# Altium schematic sheet sch_sense+act.SchDoc
size A
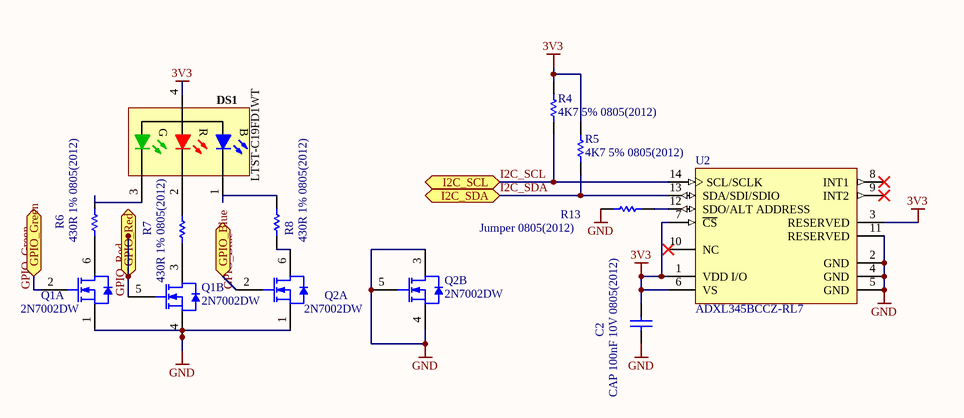
[diagram p0: sch_sense+act.SchDoc]

## Parts
(Parts that share a designator on the sheet are numbered #1, #2 ... from top to bottom, then left to right.)
C2  CAP 100nF 10V 0805(2012)  [CAPC0805(2012)100_N]
DS1  LTST-C19FD1WT  [LITO-LEDL210W160H55_V]
Q1#1  2N7002DW  [INF-PG-SOT-363_N]  (part A of 2)
Q1#2  2N7002DW  [INF-PG-SOT-363_N]  (part B of 2)
Q2#1  2N7002DW  [INF-PG-SOT-363_N]  (part A of 2)
Q2#2  2N7002DW  [INF-PG-SOT-363_N]  (part B of 2)
R4  4K7 5% 0805(2012)  [RESC0805(2012)_N]
R5  4K7 5% 0805(2012)  [RESC0805(2012)_N]
R6  430R 1% 0805(2012)  [RESC0805(2012)_L]
R7  430R 1% 0805(2012)  [RESC0805(2012)_L]
R8  430R 1% 0805(2012)  [RESC0805(2012)_L]
R13  Jumper 0805(2012)  [RESC0805(2012)_N]
U2  ADXL345BCCZ-RL7  [ADI-CC-14-1_V]

## Ports
GPIO_Blue (bidir), GPIO_Green (bidir), GPIO_Red (bidir), I2C_SCL (bidir), I2C_SDA (bidir)

## Nets
3V3: C2.1 DS1.4(A) R4.1 R5.1 U2.1(VDD_I/O) U2.3(RESERVED) U2.6(VS) U2.7(~{CS})
GND: C2.2 Q1#1.1(SOURCE_(1)) Q1#2.4(SOURCE_(2)) Q2#1.1(SOURCE_(1)) Q2#2.3(DRAIN_(2)) Q2#2.4(SOURCE_(2)) Q2#2.5(GATE_(2)) R13.1 U2.2(GND) U2.4(GND) U2.5(GND) U2.11(RESERVED)
GPIO_Blue: Q2#1.2(GATE_(1)) ; port GPIO_Blue
GPIO_Green: Q1#1.2(GATE_(1)) ; port GPIO_Green
GPIO_Red: Q1#2.5(GATE_(2)) ; port GPIO_Red
I2C_SCL: R4.2 U2.14(SCL/SCLK) ; port I2C_SCL
I2C_SDA: R5.2 U2.13(SDA/SDI/SDIO) ; port I2C_SDA
NetDS1_1: DS1.1(B) R8.2
NetDS1_2: DS1.2(R) R7.2
NetDS1_3: DS1.3(G) R6.2
NetQ1#1_6: Q1#1.6(DRAIN_(1)) R6.1
NetQ1#2_3: Q1#2.3(DRAIN_(2)) R7.1
NetQ2#1_6: Q2#1.6(DRAIN_(1)) R8.1
NetR13_2: R13.2 U2.12(SDO/ALT_ADDRESS)

Not connected (* = marked no-connect by the designer): U2 8(INT1)* 9(INT2)* 10(NC)*

## Library data of the parts
C2 = CMP-1036-04396-1: CAP 100nF 10V ±20% 0805 (2012 Metric) Thickness 1mm SMD; Tolerance: Â±20%; Case-Metric: 2012; Case-EIA: 0805; Rated Voltage: 10 V; Value: 100nF; Technology: SMT; Max Thickness: 1 mm
DS1 = CMP-0258-00001-1: SMD RGB Diffused; Reverse Voltage: 5 V; Forward Voltage Green: 3.5 V; Luminous Intensity Green: 280 MCD; Luminous Intensity Red: 180 MCD; Wavelength at Peak Emission Red: 611 nm; Forward Voltage Red: 2.0 V; Luminous Intensity Blue: 112 MCD; Power Dissipation Green: 80 mW; Power Dissipation Red: 75 mW; Wavelength at Peak Emission Blue: 468 nm; Wavelength at Peak Emission Green: 520 nm; PackageDescription: 4-Pin SMT LED, 2.1 x 1.6 mm Body, 0.55 mm Thickness; Mounting Technology: Suface Mount; PartNumber: LTST-C19FD1WT; LED Light Colour: RGB; PackageReference: LEDL210W160H55; ComponentLink1Description: Manufacturer URL; Power Dissipation Blue: 80 mW; ComponentLink2URL: Data Source:http://media.digikey.com/pdf/Data%20Sheets/Lite-On%20PDFs/LTST-C19FD1WT.pdf; Forward Voltage Blue: 3.5 V; ComponentLink2Description: URL Link1; ComponentLink1URL: http://www.liteon.com/
Q1#1 Q1#2 Q2#1 Q2#2 = CMP-1149-00044-1: N-Channel OptiMOS Small-Signal-Transistor, 60 V VDS, 0.3 A ID, -55 to 150 degC, PG-SOT-363, Reel, Green; Manufacturer: Infineon; ID (max): 0.3Â A; Green: TRUE; RthJA (max): 250 K/W; VDS (max): 60 V; VGS(th) (min): 1.5Â V; QG: 0.4Â nC; Ptot (max): 0.5Â W; VGS(th) (max): 2.5Â V; IDpuls (max): 1.2Â A; RDS (on) (max): 3,000 mOhm; RDS (on) (max) (@4.5V): 4,000 mOhm; PackageDescription: 6-Pin Small Outline Transistor Package, 2 x 1.25 mm Body, 0.65 mm Pitch; ComponentLink3Description: Package Specification; ComponentLink3URL: http://www.infineon.com/dgdl/SOT363-Package_Overview.pdf?folderId=db3a30431936bc4b01195360bd8f3cdc&fileId=db3a30431936bc4b0119536b62bf3cf5; ComponentLink1URL: http://www.infineon.com/; PackageVersion: Apr-08; ComponentLink2Description: Datasheet; Packing: Reel; Mounting Technology: Surface Mount; Halogen-free: TRUE; PackageReference: PG-SOT-363; ComponentLink1Description: Manufacturer URL; PartNumber: 2N7002DW; DatasheetVersion: Rev. 2.2; ComponentLink2URL: http://www.infineon.com/dgdl/2N7002DW_Rev2.2_.pdf?folderId=db3a3043156fd573011622e10b5c1f67&fileId=db3a30431a5c32f2011ad94ed41363f2
  Q1#2 Q2#2: PartId: 2
R4 R5 = CMP-1013-00090-1: 4K7 0.125W 5% 0805 (2012 Metric)  SMD; Case-EIA: 0805; Value: 4700.00 Ohm; Case-Metric: 2012; Power: 0.125 W; Tolerance: 5 %; Technology: SMT
R6-R8 = CMP-1013-00468-1: 430R 0.125W 1% 0805 (2012 Metric)  SMD; Value: 430.00 Ohm; Case-Metric: 2012; Case-EIA: 0805; Power: 0.125 W; Tolerance: 1 %; Technology: SMT
R13 = CMP-1013-00001-1: Jumper 0805 (2012 Metric); Case-EIA: 0805; Value: 0.00 Ohm; Tolerance: None; Case-Metric: 2012; Technology: SMT; Power: None
U2 = CMP-0885-00033-1: 3-Axis, +/-2 g / +/-4 g / +/-8 g / +/-16 g Digital Accelerometer with Digital Output, 1.6 KHz BW, Industrial, 14-pin LGA, Reel; Manufacturer: Analog Devices; Supply Current: 140 uA; Voltage Supply (V): 2.0 to 3.6; -3dB Bandwidth: 1.6 KHz; Sensitivity: 256/128/64/32 LSB/g; # of Axes: 3; Output Type: Digital; PackageDescription: 14-Pin Land Grid Array, 3 x 5 mm Body, 0.8 mm Pitch; ComponentLink1URL: http://www.analog.com/en/index.html; ComponentLink2Description: Datasheet; PartNumber: ADXL345BCCZ-RL7; ComponentLink3Description: Package Specification; ComponentLink4URL: http://www.analog.com/en/mems-sensors/mems-inertial-sensors/adxl345/products/product.html; PackageVersion: 03-16-2010-A, 03/2010; ComponentLink1Description: Manufacturer URL; ComponentLink2URL: http://www.analog.com/static/imported-files/data_sheets/ADXL345.pdf; DatasheetVersion: Rev. D; PackageReference: CC-14-1; Packing: Reel; Mounting Technology: Surface Mount; ComponentLink4Description: Product URL; ComponentLink3URL: http://www.analog.com/static/imported-files/data_sheets/ADXL343.pdf